# EAGLE design tps63020-buck-boost-flashlight-driver-17mm-mk-1.3.0 (EAGLE 9.3.1)
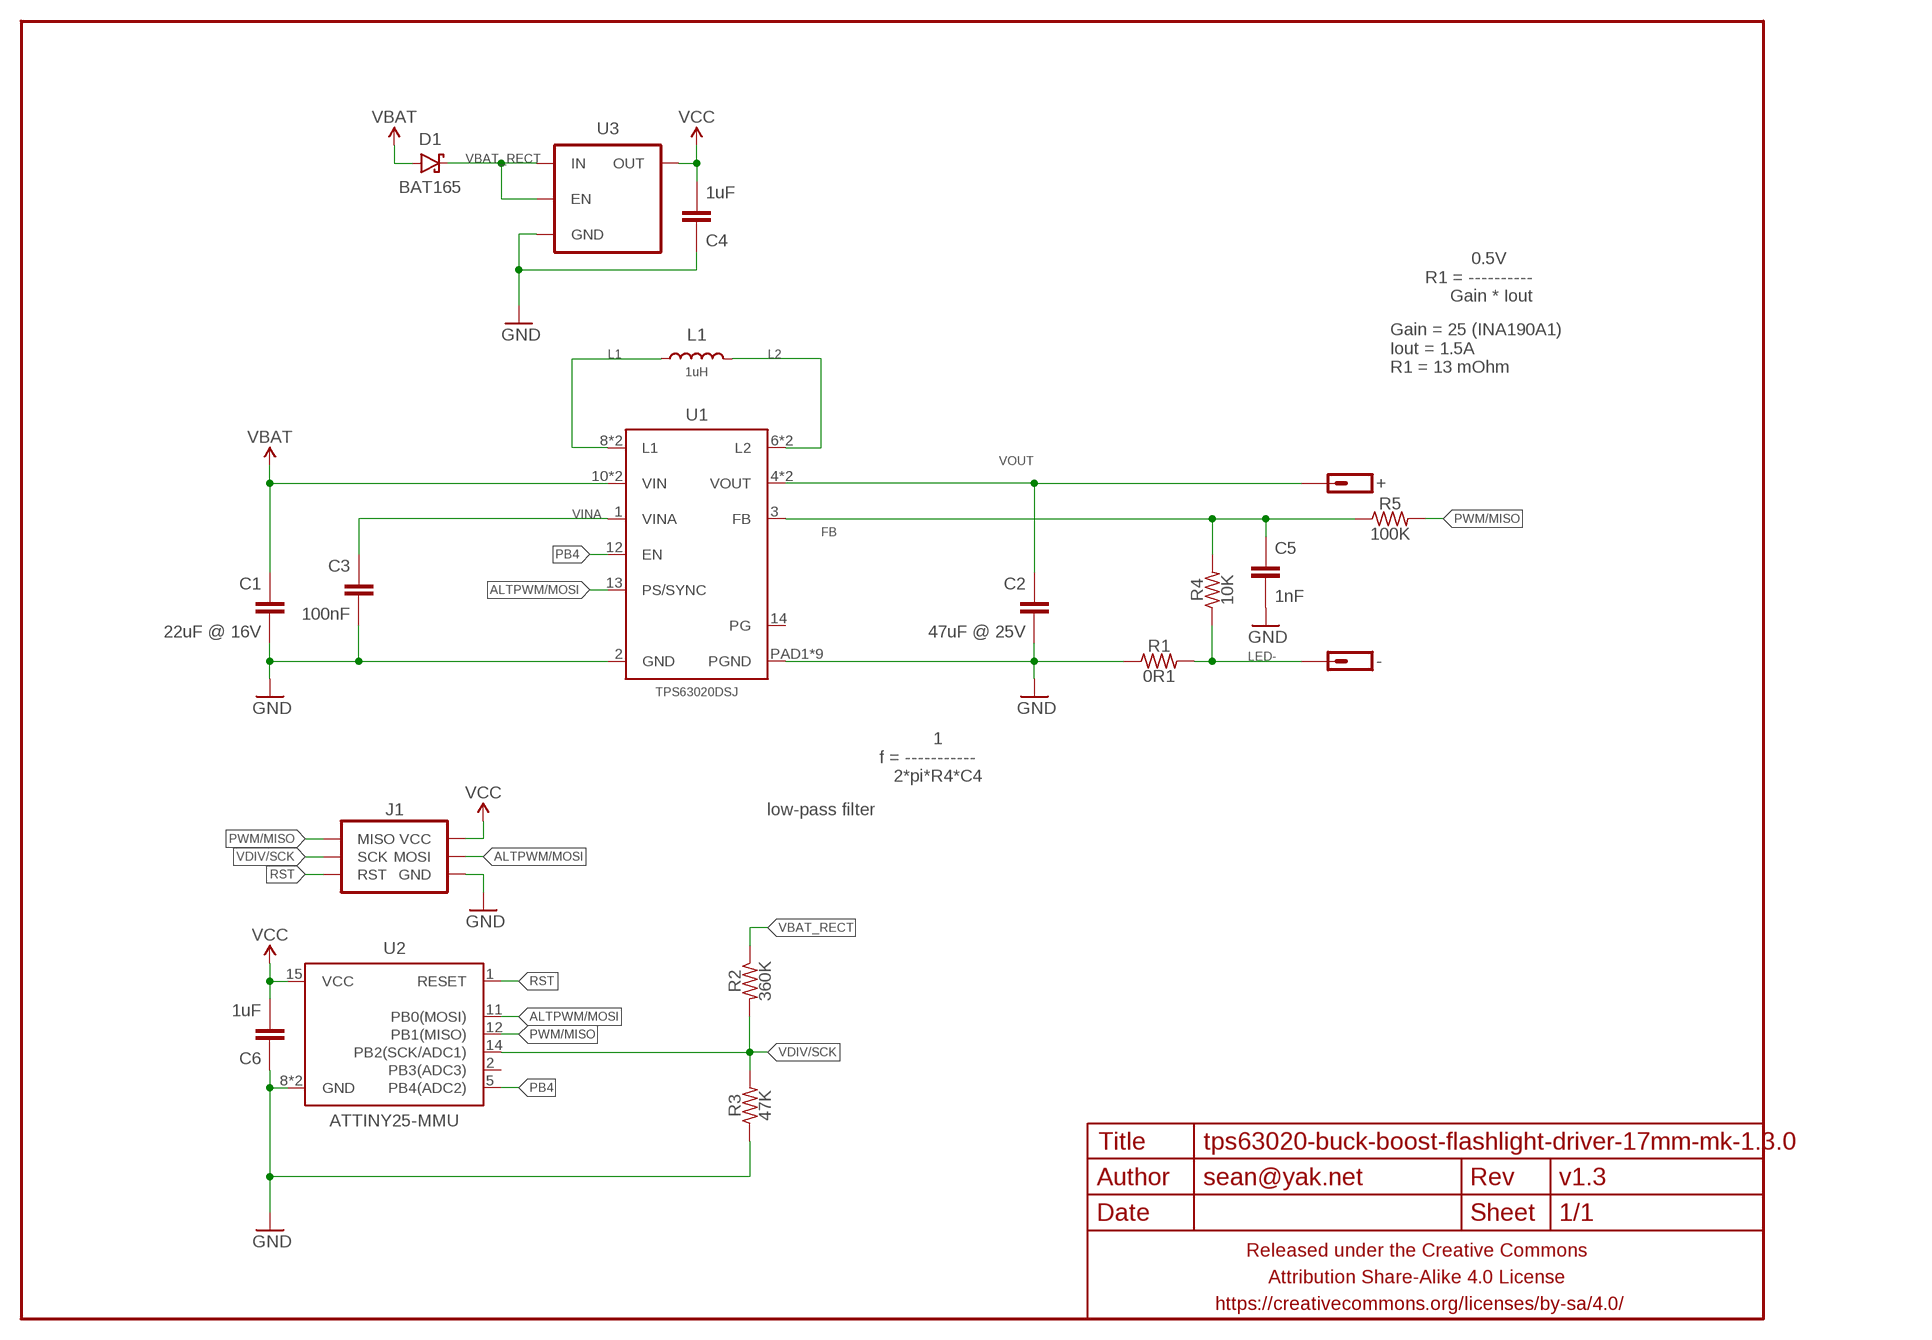
[diagram p0: schematic, sheet 1]

## Parts
+  M01SMD-1.6MMX3.2MM  [1X01-SMD-1.6MMX3.2MM]
-  M01SMD-1.6MMX3.2MM  [1X01-SMD-1.6MMX3.2MM]
C1  22uF @ 16V  CAPACITOR-CERAMICC0805-TIGHTER  [C0805-TIGHTER]
C2  47uF @ 25V  CAPACITOR-CERAMICC1206  [C1206]
C3  100nF  CAPACITOR-CERAMICC0402  [C0402]
C4  1uF  CAPACITOR-CERAMICC0402  [C0402]
C5  1nF  CAPACITOR-CERAMICC0402  [C0402]
C6  1uF  CAPACITOR-CERAMICC0402  [C0402]
D1  BAT165  DIODE-SCHOTTKYSOD323  [SOD323-SCHOTTKY]
FRAME1  FRAME-LETTERNO_PACKAGE  [DUMMY]
J1  AVR_SPI_PRG_6SMD-1.27MM  [2X3-1.27MM-SMD]
L1  1uH  INDUCTORXAL50X0  [XAL50X0]
R1  0R1  RESISTORR1206  [R1206]
R2  360K  RESISTORR0402  [R0402]
R3  47K  RESISTORR0402  [R0402]
R4  10K  RESISTORR0402  [R0402]
R5  100K  RESISTORR0402  [R0402]
U1  TPS63020DSJ  [VSON-14-4MMX3MM]
U2  ATTINY25-MMU  ATTINY45TINY85-20-QFN  [QFN20]
U3  V_REG_ENTLV700XXDCK-TIGHTER  [SC70-TIGHTER]

## Nets
ALTPWM/MOSI: J1.4(MOSI) U1.13(PS/SYNC) U2.11(PB0(MOSI))
FB: C5.1 R4.2 R5.1 U1.3(FB)
GND: C1.2 C2.2 C3.2 C4.1 C5.2 C6.1 J1.6(GND) R1.1 R3.1 U1.2(GND) U1.PAD1(PGND) U1.PAD2(PGND) U1.PAD3(PGND) U1.PAD4(PGND) U1.PAD5(PGND) U1.PAD6(PGND) U1.PAD7(PGND) U1.PAD8(PGND) U1.PADCENTER(PGND) U2.8(GND) U2.PAD(GND) U3.2(GND)
L1: L1.P$1 U1.8(L1) U1.9(L1)
L2: L1.P$2 U1.6(L2) U1.7(L2)
LED-: -.P$1 R1.2 R4.1
PB4: U1.12(EN) U2.5(PB4(ADC2))
PWM/MISO: J1.1(MISO) R5.2 U2.12(PB1(MISO))
RST: J1.5(RST) U2.1(RESET)
VBAT: C1.1 D1.A U1.10(VIN) U1.11(VIN)
VBAT_RECT: D1.C R2.1 U3.1(IN) U3.3(EN)
VCC: C4.2 C6.2 J1.2(VCC) U2.15(VCC) U3.5(OUT)
VDIV/SCK: J1.3(SCK) R2.2 R3.2 U2.14(PB2(SCK/ADC1))
VINA: C3.1 U1.1(VINA)
VOUT: +.P$1 C2.1 U1.4(VOUT) U1.5(VOUT)
Unconnected: U1.14(PG) U2.2(PB3(ADC3))

## Notes on the sheet
- 0.5V
  R1 = ----------
       Gain * Iout
- Gain = 25 (INA190A1)
  Iout = 1.5A
  R1 = 13 mOhm
- 1
  f = -----------
      2*pi*R4*C4
- low-pass filter

## Library data of the parts
+ - = a_parts:M01: Header 1 Standard 1-pin 0.1" header. Use with straight break away headers (SKU : PRT-00116), right angle break away headers (PRT-00553), swiss pins (PRT-00743), machine pins (PRT-00117), and female headers (PRT-00115).
C1-C6 = a_parts:CAPACITOR-CERAMIC: CAPACITOR, European symbol
D1 = a_parts:DIODE-SCHOTTKY: Schottky diodes in SFE's production catalog BAT20J 1A 23V 0.62Vf RB751 120mA 40V 0.37Vf PMEG4005EJ 0.5A 40V 0.42Vf MBRA140 1A 40V 0.5Vf B340A 3A 40V SMA
FRAME1 = a_parts:FRAME-LETTER: Schematic Frame Standard 8.5x11 US Letter frame; DESIGNER: sean@yak.net; VERSION: v1.3
J1 = a_parts:AVR_SPI_PRG_6: AVR ISP 6 Pin This is the reduced ISP connector for AVR programming. Common on Arduino. This footprint will take up less PCB space and can be used with a 10-pin to 6-pin adapter such as SKU: BOB-08508 **Special note about "TEST_POINT" package. The stop mask is on the top side, so if you want your programming test points to be on the bottom of your board, make sure to place this package on the bottom side of the board. This also ensure that the orientation to program from the bottom side will be correct.
L1 = a_parts:INDUCTOR: Inductors Basic Inductor/Choke - 0603 and 1206. Footprints are not proven and vary greatly between part numbers. SRN6045- 33uH, 20% 1.4A SDR0403-560KL - 56uH, 10%, 500mA RMS/740mA peak
R1-R5 = a_parts:RESISTOR: RESISTOR, American symbol
U1 = a_parts:TPS63020
U2 = a_parts:ATTINY45: Atmel 8-pin 2/4/8kB flash uC
U3 = a_parts:V_REG_EN

## Board
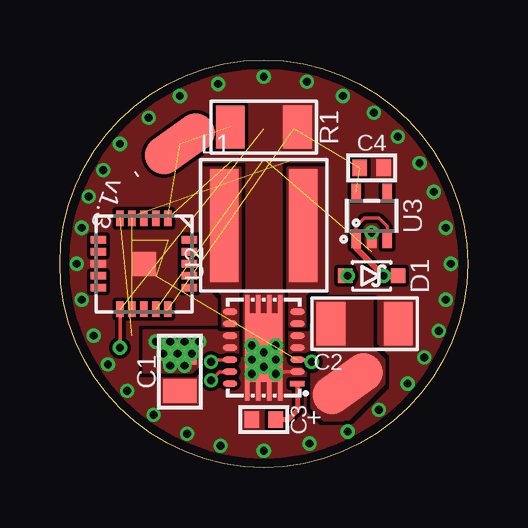
[diagram p1: board, top side]
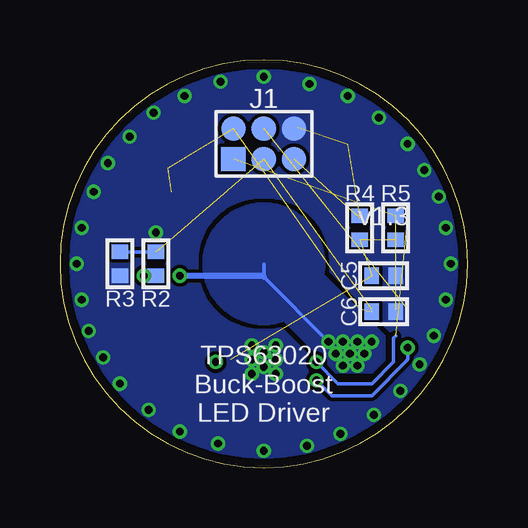
[diagram p2: board, bottom side, seen from below]

Size 17 x 17 mm. Coordinates in mm from the lower left corner, seen from the top.
Outline: 0,8.5 arc-180 17,8.5 arc-180 0,8.5
Copper layers (1*16): Top 0.035559375mm / dielectric 1.6mm / Bottom 0.035559375mm
Design rules "oshpark-2layer": minimum track width 6mil, minimum drill 10mil, track to track 6mil, track to pad 6mil, pad to pad 6mil, via to via 6mil, smd to smd 0mil, copper to edge 15mil, drill to drill 6mil, minimum pad ring 5mil, minimum via ring 5mil, stop-mask expansion 2.5mil, vias tented up to drill 20mil, thermal gap 10mil

### Footprints (pad centres in the part's own frame; a part is rotated, then mirrored left to right if it is on the bottom)
1X01-SMD-1.6MMX3.2MM = smd 1.6 x 3.2: P$1 0,0
C0805-TIGHTER = smd 1 x 1.4: 1 -0.8,0; 2 0.8,0
C1206 = smd 1.2 x 1.8: 1 -1.4,0; 2 1.4,0
C0402 = smd 0.6 x 0.7: 1 -0.5,0; 2 0.5,0
SOD323-SCHOTTKY = smd 0.6 x 0.6: A -1.1,0; C 1.1,0
2X3-1.27MM-SMD = smd 1.016 x 1.016: 1 -1.27,-0.635; 2 -1.27,0.635; 3 0,-0.635; 4 0,0.635; 5 1.27,-0.635; 6 1.27,0.635
XAL50X0 = smd 1.18 x 4.7: P$1 -1.651,0; P$2 1.651,0
R1206 = smd 1.2 x 1.8: 1 -1.4,0; 2 1.4,0
R0402 = smd 0.6 x 0.7: 1 -0.5,0; 2 0.5,0
VSON-14-4MMX3MM = smd 0.24 x 0.6: 1 -1.5,-1.4; 2 -1,-1.4; 3 -0.5,-1.4; 4 0,-1.4; 5 0.5,-1.4; 6 1,-1.4; 7 1.5,-1.4; 8 1.5,1.4; 9 1,1.4; 10 0.5,1.4; 11 0,1.4; 12 -0.5,1.4; 13 -1,1.4; 14 -1.5,1.4 | smd 0.775 x 0.2: PAD1 -1.812,0.69; PAD2 -1.812,0.23; PAD3 -1.812,-0.23; PAD4 -1.812,-0.69; PAD5 1.812,-0.69; PAD6 1.812,-0.23; PAD7 1.812,0.23; PAD8 1.812,0.69 | smd 2.85 x 1.58: PADCENTER 0,0
QFN20 = smd 0.65 x 0.3: 1 -1.9,1; 2 -1.9,0.5; 3 -1.9,0; 4 -1.9,-0.5; 5 -1.9,-1; 11 1.9,-1; 12 1.9,-0.5; 13 1.9,0; 14 1.9,0.5; 15 1.9,1 | smd 0.3 x 0.65: 6 -1,-1.9; 7 -0.5,-1.9; 8 0,-1.9; 9 0.5,-1.9; 10 1,-1.9; 16 1,1.9; 17 0.5,1.9; 18 0,1.9; 19 -0.5,1.9; 20 -1,1.9 | smd 1 x 1: PAD 0,0
SC70-TIGHTER = smd 0.4 x 0.7: 1 -0.65,-1; 2 0,-1; 3 0.65,-1; 4 0.65,1; 5 -0.65,1

### Placement (x,y rotation side)
+  12,3.5 305 top
-  5,13.5 125 top
C1  5,4 270 top
C2  12.7,6 0 top
C3  8.5,2 180 top
C4  13,12.5 180 top
C5  3.5,8 0 bottom
C6  3.5,6.5 180 bottom
D1  13,8 0 top
FRAME1  -0.5,-0.5 0 top
J1  8.5,13.5 0 bottom
L1  8.5,10.1 0 top
R1  8.5,14.2 180 top
R2  13,8.5 90 bottom
R3  14.5,8.5 90 bottom
R4  4.5,10 270 bottom
R5  3,10 90 bottom
U1  8.5,5 90 top
U2  3.5,8.5 270 top
U3  13,10.5 0 top

### Tracks (layer width: path | path; a pad name or v marks a point on that pad's centre or on a via)
ALTPWM/MOSI  (via drill 0.33)  (1 unrouted)
  Top 0.152: U1.13 6.66,4 v6.3,3.64 | U2.11 v2.5,5
  Bottom 0.152: v2.5,5 2.5,4.54 2.52,4.52 2.52,4.48 4,3 5.66,3 v6.3,3.64
FB  (via drill 0.33)  (3 unrouted)
  Top 0.152: v10.5,4.4 10.4,4.5 U1.3
GND  (via drill 0.33)
  Top 0.152: U1.2 9.1,4 v9,3.9
  other vias: 0.7,8.5 16.3,8.5 8.5,16.3 2.5,13.5 1.2,11.3 0.9,10 1.8,12.4 5,15.5 3.7,14.6 6.6,16 14.1,13.8 15.6,11.5 15,12.7 16.1,10 11.8,15.5 13.1,14.8 10.3,16.1 8.5,0.7 14.5,3.5 15.8,5.7 16.1,7 15.2,4.6 12,1.5 13.3,2.4 10.4,1 2.8,3.2 1.4,5.5 2,4.3 0.9,7 5.3,1.4 3.9,2.2 6.7,0.9 8,3.9 8,4.5 8.5,4.2 8,5.1 9,4.5 9,5.1 8.5,4.8 13,9.8
  pour Bottom (isolate 0.152, rank 6, no thermals): 8.5,0 arc-90 0,8.5 arc-90 8.5,17 arc-90 17,8.5 arc-90
  pour Top (isolate 0.152, rank 6, no thermals): 8.5,0 arc-90 0,8.5 arc-90 8.5,17 arc-90 17,8.5 arc-90
L1
  pour Top (rank 4, no thermals): 6,12.5 7.5,12.5 7.5,7.5 7.4,7.4 7.4,5.9 6.8,5.9 6.8,7 6.8,7.2 6.5,7.5 6,7.5
L2
  pour Top (rank 4, no thermals): 9.6,5.9 10.2,5.9 10.2,7 10.2,7.2 10.5,7.5 11,7.5 11,12.5 9.5,12.5 9.5,7.5 9.6,7.4
LED-  (2 unrouted)
PB4  (via drill 0.33)  (1 unrouted)
  Top 0.152: U1.12 6.4,4.5 v6.3,4.4
  Bottom 0.152: v6.3,4.4 5.4,3.5 4,3.5 3.1,4.4 3.1,5.4 3,5.5
PWM/MISO  (2 unrouted)
RST  (1 unrouted)
VBAT  (via drill 0.33)
  Top 0.25: v12,8 D1.A
  Bottom 0.152: v5.8,5.25 8.5,7.95 8.5,8.5
  Bottom 0.25: 8.5,7.95 8.55,8 v12,8
  other vias: 5.2,5.25 4.6,5.25 4,5.25 4.3,4.75 4.9,4.75 5.5,4.75 5.2,4.25 4.6,4.25
  pour Bottom (isolate 0.152, no thermals): 6,8.5 arc-180 11,8.5 arc-180
  pour Top (rank 5, no thermals): 3.5,5.7 3.5,4 5.5,4 6.3,4.8 7.4,4.8 7.4,5.7
  pour Bottom (rank 4, no thermals): 3.5,4.5 4,4 5.5,4 8.5,7 8.5,8.5 6.5,8.5 3.5,5.5
VBAT_RECT  (via drill 0.33)
  Top 0.152: U3.3 13.65,10.05 13.3,10.4 12.7,10.4 12.35,10.05 U3.1
  Top 0.25: U3.1 12.35,9.15 v13.5,8 D1.C
  Bottom 0.152: R2.1 v13.5,8
VCC  (4 unrouted)
VDIV/SCK  (2 unrouted)
  Bottom 0.152: R3.2 R2.2
VINA
  Top 0.2: U1.1 9.9,2.4 9.5,2 C3.1
VOUT
  pour Top (rank 5, no thermals): 9.6,5.7 10.2,5.7 10.5,6 10.5,7 13,7 13,5 13.5,4.5 13.5,3.5 12,2 11,2 10.5,2.5 10.5,4.5 10.2,4.8 9.6,4.8

### Text on the board
bPlace: TPS63020 / Buck-Boost / LED Driver